# Altium project ALCT_MEZ_SPARTAN6.PrjPcb (part 4 of 5)

## Sheet FPGA_Power.SchDoc: FPGA Power
size 406 x 254 mm; Organization: UCLA High Energy Physics; DocumentNumber: 10; Revision: 2.0; SheetNumber: 10; SheetTotal: 12
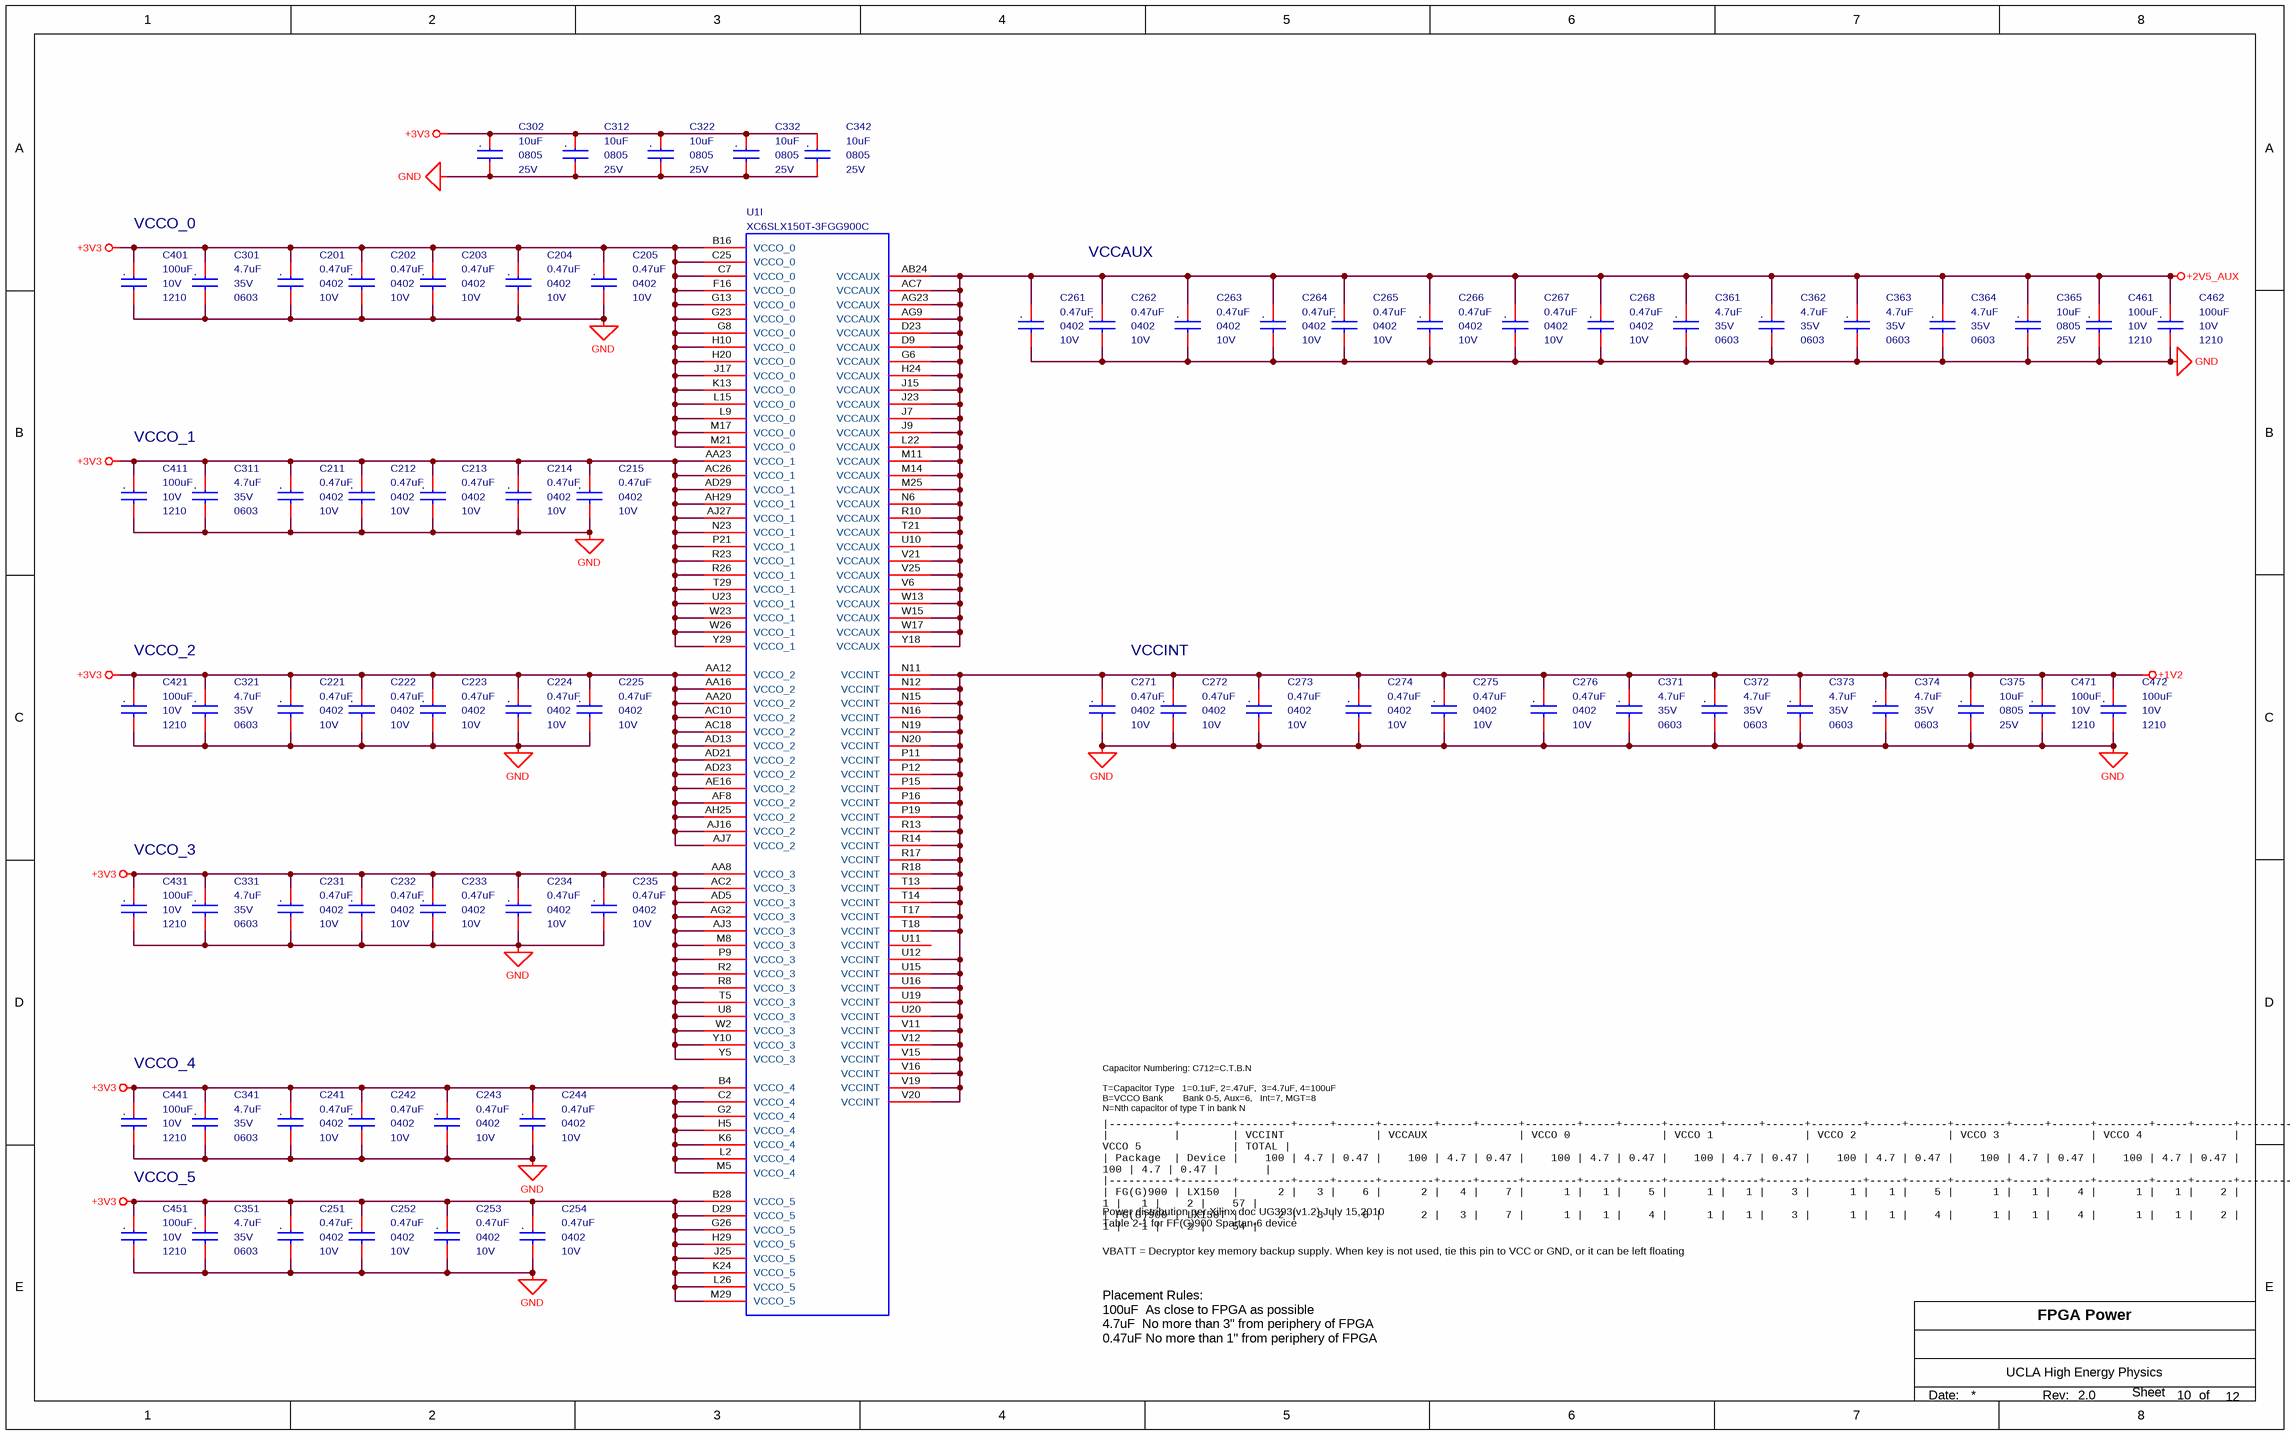
[diagram p12: FPGA_Power.SchDoc]

### Parts
C201  0.47uF  Voltage - Rated: 10V  package: 0402  [MC_S6/SM/C_0402_IPC]
C202  0.47uF  Voltage - Rated: 10V  package: 0402  [MC_S6/SM/C_0402_IPC]
C203  0.47uF  Voltage - Rated: 10V  package: 0402  [MC_S6/SM/C_0402_IPC]
C204  0.47uF  Voltage - Rated: 10V  package: 0402  [MC_S6/SM/C_0402_IPC]
C205  0.47uF  Voltage - Rated: 10V  package: 0402  [MC_S6/SM/C_0402_IPC]
C211  0.47uF  Voltage - Rated: 10V  package: 0402  [MC_S6/SM/C_0402_IPC]
C212  0.47uF  Voltage - Rated: 10V  package: 0402  [MC_S6/SM/C_0402_IPC]
C213  0.47uF  Voltage - Rated: 10V  package: 0402  [MC_S6/SM/C_0402_IPC]
C214  0.47uF  Voltage - Rated: 10V  package: 0402  [MC_S6/SM/C_0402_IPC]
C215  0.47uF  Voltage - Rated: 10V  package: 0402  [MC_S6/SM/C_0402_IPC]
C221  0.47uF  Voltage - Rated: 10V  package: 0402  [MC_S6/SM/C_0402_IPC]
C222  0.47uF  Voltage - Rated: 10V  package: 0402  [MC_S6/SM/C_0402_IPC]
C223  0.47uF  Voltage - Rated: 10V  package: 0402  [MC_S6/SM/C_0402_IPC]
C224  0.47uF  Voltage - Rated: 10V  package: 0402  [MC_S6/SM/C_0402_IPC]
C225  0.47uF  Voltage - Rated: 10V  package: 0402  [MC_S6/SM/C_0402_IPC]
C231  0.47uF  Voltage - Rated: 10V  package: 0402  [MC_S6/SM/C_0402_IPC]
C232  0.47uF  Voltage - Rated: 10V  package: 0402  [MC_S6/SM/C_0402_IPC]
C233  0.47uF  Voltage - Rated: 10V  package: 0402  [MC_S6/SM/C_0402_IPC]
C234  0.47uF  Voltage - Rated: 10V  package: 0402  [MC_S6/SM/C_0402_IPC]
C235  0.47uF  Voltage - Rated: 10V  package: 0402  [MC_S6/SM/C_0402_IPC]
C241  0.47uF  Voltage - Rated: 10V  package: 0402  [MC_S6/SM/C_0402_IPC]
C242  0.47uF  Voltage - Rated: 10V  package: 0402  [MC_S6/SM/C_0402_IPC]
C243  0.47uF  Voltage - Rated: 10V  package: 0402  [MC_S6/SM/C_0402_IPC]
C244  0.47uF  Voltage - Rated: 10V  package: 0402  [MC_S6/SM/C_0402_IPC]
C251  0.47uF  Voltage - Rated: 10V  package: 0402  [MC_S6/SM/C_0402_IPC]
C252  0.47uF  Voltage - Rated: 10V  package: 0402  [MC_S6/SM/C_0402_IPC]
C253  0.47uF  Voltage - Rated: 10V  package: 0402  [MC_S6/SM/C_0402_IPC]
C254  0.47uF  Voltage - Rated: 10V  package: 0402  [MC_S6/SM/C_0402_IPC]
C261  0.47uF  Voltage - Rated: 10V  package: 0402  [MC_S6/SM/C_0402_IPC]
C262  0.47uF  Voltage - Rated: 10V  package: 0402  [MC_S6/SM/C_0402_IPC]
C263  0.47uF  Voltage - Rated: 10V  package: 0402  [MC_S6/SM/C_0402_IPC]
C264  0.47uF  Voltage - Rated: 10V  package: 0402  [MC_S6/SM/C_0402_IPC]
C265  0.47uF  Voltage - Rated: 10V  package: 0402  [MC_S6/SM/C_0402_IPC]
C266  0.47uF  Voltage - Rated: 10V  package: 0402  [MC_S6/SM/C_0402_IPC]
C267  0.47uF  Voltage - Rated: 10V  package: 0402  [MC_S6/SM/C_0402_IPC]
C268  0.47uF  Voltage - Rated: 10V  package: 0402  [MC_S6/SM/C_0402_IPC]
C271  0.47uF  Voltage - Rated: 10V  package: 0402  [MC_S6/SM/C_0402_IPC]
C272  0.47uF  Voltage - Rated: 10V  package: 0402  [MC_S6/SM/C_0402_IPC]
C273  0.47uF  Voltage - Rated: 10V  package: 0402  [MC_S6/SM/C_0402_IPC]
C274  0.47uF  Voltage - Rated: 10V  package: 0402  [MC_S6/SM/C_0402_IPC]
C275  0.47uF  Voltage - Rated: 10V  package: 0402  [MC_S6/SM/C_0402_IPC]
C276  0.47uF  Voltage - Rated: 10V  package: 0402  [MC_S6/SM/C_0402_IPC]
C301  4.7uF  Voltage - Rated: 35V  package: 0603  [MC_S6/SM/C_0603_IPC]
C302  10uF  Voltage - Rated: 25V  package: 0805  [MC_S6/SM/C_0805_IPC]
C311  4.7uF  Voltage - Rated: 35V  package: 0603  [MC_S6/SM/C_0603_IPC]
C312  10uF  Voltage - Rated: 25V  package: 0805  [MC_S6/SM/C_0805_IPC]
C321  4.7uF  Voltage - Rated: 35V  package: 0603  [MC_S6/SM/C_0603_IPC]
C322  10uF  Voltage - Rated: 25V  package: 0805  [MC_S6/SM/C_0805_IPC]
C331  4.7uF  Voltage - Rated: 35V  package: 0603  [MC_S6/SM/C_0603_IPC]
C332  10uF  Voltage - Rated: 25V  package: 0805  [MC_S6/SM/C_0805_IPC]
C341  4.7uF  Voltage - Rated: 35V  package: 0603  [MC_S6/SM/C_0603_IPC]
C342  10uF  Voltage - Rated: 25V  package: 0805  [MC_S6/SM/C_0805_IPC]
C351  4.7uF  Voltage - Rated: 35V  package: 0603  [MC_S6/SM/C_0603_IPC]
C361  4.7uF  Voltage - Rated: 35V  package: 0603  [MC_S6/SM/C_0603_IPC]
C362  4.7uF  Voltage - Rated: 35V  package: 0603  [MC_S6/SM/C_0603_IPC]
C363  4.7uF  Voltage - Rated: 35V  package: 0603  [MC_S6/SM/C_0603_IPC]
C364  4.7uF  Voltage - Rated: 35V  package: 0603  [MC_S6/SM/C_0603_IPC]
C365  10uF  Voltage - Rated: 25V  package: 0805  [MC_S6/SM/C_0805_IPC]
C371  4.7uF  Voltage - Rated: 35V  package: 0603  [MC_S6/SM/C_0603_IPC]
C372  4.7uF  Voltage - Rated: 35V  package: 0603  [MC_S6/SM/C_0603_IPC]
C373  4.7uF  Voltage - Rated: 35V  package: 0603  [MC_S6/SM/C_0603_IPC]
C374  4.7uF  Voltage - Rated: 35V  package: 0603  [MC_S6/SM/C_0603_IPC]
C375  10uF  Voltage - Rated: 25V  package: 0805  [MC_S6/SM/C_0805_IPC]
C401  100uF  Voltage - Rated: 10V  package: 1210  [MC_S6/SM/C_1210_IPC]
C411  100uF  Voltage - Rated: 10V  package: 1210  [MC_S6/SM/C_1210_IPC]
C421  100uF  Voltage - Rated: 10V  package: 1210  [MC_S6/SM/C_1210_IPC]
C431  100uF  Voltage - Rated: 10V  package: 1210  [MC_S6/SM/C_1210_IPC]
C441  100uF  Voltage - Rated: 10V  package: 1210  [MC_S6/SM/C_1210_IPC]
C451  100uF  Voltage - Rated: 10V  package: 1210  [MC_S6/SM/C_1210_IPC]
C461  100uF  Voltage - Rated: 10V  package: 1210  [MC_S6/SM/C_1210_IPC]
C462  100uF  Voltage - Rated: 10V  package: 1210  [MC_S6/SM/C_1210_IPC]
C471  100uF  Voltage - Rated: 10V  package: 1210  [MC_S6/SM/C_1210_IPC]
C472  100uF  Voltage - Rated: 10V  package: 1210  [MC_S6/SM/C_1210_IPC]
U1  XC6SLX150T-3FGG900C  [MC_S6/BGA/FGG900]  (part I of 13)

### Nets
+1V2: C271.1 C272.1 C273.1 C274.1 C275.1 C276.1 C371.1 C372.1 C373.1 C374.1 C375.1 C471.1 C472.1 U1.N11(VCCINT) U1.N12(VCCINT) U1.N15(VCCINT) U1.N16(VCCINT) U1.N19(VCCINT) U1.N20(VCCINT) U1.P11(VCCINT) U1.P12(VCCINT) U1.P15(VCCINT) U1.P16(VCCINT) U1.P19(VCCINT) U1.R13(VCCINT) U1.R14(VCCINT) U1.R17(VCCINT) U1.R18(VCCINT) U1.T13(VCCINT) U1.T14(VCCINT) U1.T17(VCCINT) U1.T18(VCCINT) U1.U12(VCCINT) U1.U15(VCCINT) U1.U16(VCCINT) U1.U19(VCCINT) U1.U20(VCCINT) U1.V11(VCCINT) U1.V12(VCCINT) U1.V15(VCCINT) U1.V16(VCCINT) U1.V19(VCCINT) U1.V20(VCCINT)
+2V5_AUX: C261.1 C262.1 C263.1 C264.1 C265.1 C266.1 C267.1 C268.1 C361.1 C362.1 C363.1 C364.1 C365.1 C461.1 C462.1 U1.AB24(VCCAUX) U1.AC7(VCCAUX) U1.AG9(VCCAUX) U1.AG23(VCCAUX) U1.D9(VCCAUX) U1.D23(VCCAUX) U1.G6(VCCAUX) U1.H24(VCCAUX) U1.J7(VCCAUX) U1.J9(VCCAUX) U1.J15(VCCAUX) U1.J23(VCCAUX) U1.L22(VCCAUX) U1.M11(VCCAUX) U1.M14(VCCAUX) U1.M25(VCCAUX) U1.N6(VCCAUX) U1.R10(VCCAUX) U1.T21(VCCAUX) U1.U10(VCCAUX) U1.V6(VCCAUX) U1.V21(VCCAUX) U1.V25(VCCAUX) U1.W13(VCCAUX) U1.W15(VCCAUX) U1.W17(VCCAUX) U1.Y18(VCCAUX)
+3V3: C201.1 C202.1 C203.1 C204.1 C205.1 C211.1 C212.1 C213.1 C214.1 C215.1 C221.1 C222.1 C223.1 C224.1 C225.1 C231.1 C232.1 C233.1 C234.1 C235.1 C241.1 C242.1 C243.1 C244.1 C251.1 C252.1 C253.1 C254.1 C301.1 C302.1 C311.1 C312.1 C321.1 C322.1 C331.1 C332.1 C341.1 C342.1 C351.1 C401.1 C411.1 C421.1 C431.1 C441.1 C451.1 U1.AA8(VCCO_3) U1.AA12(VCCO_2) U1.AA16(VCCO_2) U1.AA20(VCCO_2) U1.AA23(VCCO_1) U1.AC2(VCCO_3) U1.AC10(VCCO_2) U1.AC18(VCCO_2) U1.AC26(VCCO_1) U1.AD5(VCCO_3) U1.AD13(VCCO_2) U1.AD21(VCCO_2) U1.AD23(VCCO_2) U1.AD29(VCCO_1) U1.AE16(VCCO_2) U1.AF8(VCCO_2) U1.AG2(VCCO_3) U1.AH25(VCCO_2) U1.AH29(VCCO_1) U1.AJ3(VCCO_3) U1.AJ7(VCCO_2) U1.AJ16(VCCO_2) U1.AJ27(VCCO_1) U1.B4(VCCO_4) U1.B16(VCCO_0) U1.B28(VCCO_5) U1.C2(VCCO_4) U1.C7(VCCO_0) U1.C25(VCCO_0) U1.D29(VCCO_5) U1.F16(VCCO_0) U1.G2(VCCO_4) U1.G8(VCCO_0) U1.G13(VCCO_0) U1.G23(VCCO_0) U1.G26(VCCO_5) U1.H5(VCCO_4) U1.H10(VCCO_0) U1.H20(VCCO_0) U1.H29(VCCO_5) U1.J17(VCCO_0) U1.J25(VCCO_5) U1.K6(VCCO_4) U1.K13(VCCO_0) U1.K24(VCCO_5) U1.L2(VCCO_4) U1.L9(VCCO_0) U1.L15(VCCO_0) U1.L26(VCCO_5) U1.M5(VCCO_4) U1.M8(VCCO_3) U1.M17(VCCO_0) U1.M21(VCCO_0) U1.M29(VCCO_5) U1.N23(VCCO_1) U1.P9(VCCO_3) U1.P21(VCCO_1) U1.R2(VCCO_3) U1.R8(VCCO_3) U1.R23(VCCO_1) U1.R26(VCCO_1) U1.T5(VCCO_3) U1.T29(VCCO_1) U1.U8(VCCO_3) U1.U23(VCCO_1) U1.W2(VCCO_3) U1.W23(VCCO_1) U1.W26(VCCO_1) U1.Y5(VCCO_3) U1.Y10(VCCO_3) U1.Y29(VCCO_1)
GND: C201.2 C202.2 C203.2 C204.2 C205.2 C211.2 C212.2 C213.2 C214.2 C215.2 C221.2 C222.2 C223.2 C224.2 C225.2 C231.2 C232.2 C233.2 C234.2 C235.2 C241.2 C242.2 C243.2 C244.2 C251.2 C252.2 C253.2 C254.2 C261.2 C262.2 C263.2 C264.2 C265.2 C266.2 C267.2 C268.2 C271.2 C272.2 C273.2 C274.2 C275.2 C276.2 C301.2 C302.2 C311.2 C312.2 C321.2 C322.2 C331.2 C332.2 C341.2 C342.2 C351.2 C361.2 C362.2 C363.2 C364.2 C365.2 C371.2 C372.2 C373.2 C374.2 C375.2 C401.2 C411.2 C421.2 C431.2 C441.2 C451.2 C461.2 C462.2 C471.2 C472.2

Not connected (* = marked no-connect by the designer): U1 U11(VCCINT)

### Notes on the sheet
- VCCO_0
- VCCAUX
- VCCO_1
- VCCO_2
- VCCINT
- VCCO_3
- VCCO_4
- Capacitor Numbering: C712=C.T.B.N
  T=Capacitor Type   1=0.1uF, 2=.47uF,  3=4.7uF, 4=100uF
  B=VCCO Bank        Bank 0-5, Aux=6,   Int=7, MGT=8
  N=Nth capacitor of type T in bank N
- VCCO_5
- Power distribution per Xilinx doc UG393(v1.2) July 15,2010
  Table 2-1 for FF(G)900 Spartan-6 device
- |----------+--------+--------+-----+------+--------+-----+------+--------+-----+------+--------+-----+------+--------+-----+------+--------+-----+------+--------+-----+------+--------+-----+------+-------|
  |          |        | VCCINT              | VCCAUX              | VCCO 0              | VCCO 1              | VCCO 2              | VCCO 3              | VCCO 4              | VCCO 5              | TOTAL |
  | Package  | Device |    100 | 4.7 | 0.47 |    100 | 4.7 | 0.47 |    100 | 4.7 | 0.47 |    100 | 4.7 | 0.47 |    100 | 4.7 | 0.47 |    100 | 4.7 | 0.47 |    100 | 4.7 | 0.47 |    100 | 4.7 | 0.47 |       |
  |----------+--------+--------+-----+------+--------+-----+------+--------+-----+------+--------+-----+------+--------+-----+------+--------+-----+------+--------+-----+------+--------+-----+------+-------|
  | FG(G)900 | LX150  |      2 |   3 |    6 |      2 |   4 |    7 |      1 |   1 |    5 |      1 |   1 |    3 |      1 |   1 |    5 |      1 |   1 |    4 |      1 |   1 |    2 |      1 |   1 |    2 |    57 |
  | FG(G)900 | LX150T |      2 |   3 |    6 |      2 |   3 |    7 |      1 |   1 |    4 |      1 |   1 |    3 |      1 |   1 |    4 |      1 |   1 |    4 |      1 |   1 |    2 |      1 |   1 |    2 |    54 |
  |----------+--------+--------+-----+------+--------+-----+------+--------+-----+------+--------+-----+------+--------+-----+------+--------+-----+------+--------+-----+------+--------+-----+------+-------|
- VBATT = Decryptor key memory backup supply. When key is not used, tie this pin to VCC or GND, or it can be left floating
- Placement Rules:
  100uF  As close to FPGA as possible
  4.7uF  No more than 3" from periphery of FPGA
  0.47uF No more than 1" from periphery of FPGA
- Date:
- Rev:
- of
- Sheet
- (in symbol GRM21BR61E106KA73L) .
- (in symbol GRM155R61A474KE15J) .
- (in symbol GRM188R6YA475KE15D) .
- (in symbol LMK325BJ107MM-T) .

### Library data of the parts
C201-C205 C211-C215 C221-C225 C231-C235 C241-C244 C251-C254 C261-C268 C271-C276 = GRM155R61A474KE15J: CAP CER 0.47UF 10V X5R 0402; Manufacturer: Murata Electronics North America; Capacitance: 0.47µF; Tolerance: ±10%; Supplier 1: Digi-Key; Manufacturer Part Number: GRM155R61A474KE15J; RoHS: RoHS Compliant; Category: Capacitors; Stock 1: 35266; Pricing 1: 1=0.1, 10=0.074, 100=0.0329, 500=0.02348, 1000=0.01845, 2500=0.01678, 5000=0.01543 (USD); Packaging: Cut Tape (CT); Part Status: Active; Operating Temperature: -55°C ~ 85°C; Features: -; Ratings: -; Applications: General Purpose; Mounting Type: Surface Mount, MLCC; Package / Case: 0402 (1005 Metric); Size / Dimension: 0.039" L x 0.020" W (1.00mm x 0.50mm); Height - Seated (Max): -; Thickness (Max): 0.022" (0.55mm); Lead Spacing: -; ComponentLink1URL: http://www.murata.com/~/media/webrenewal/support/library/catalog/products/capacitor/mlcc/c02e.ashx; ComponentLink1Description: http://www.murata.com/~/media/webrenewal/support/library/catalog/products/capacitor/mlcc/c02e.ashx; Supplier 2: Digi-Key; Stock 2: 35286; Pricing 2: 1=0.1, 10=0.074, 100=0.0329, 500=0.02348, 1000=0.01845, 2500=0.01678, 5000=0.01543 (USD); Supplier Part Number 1: 490-6305-1-ND; Supplier Part Number 2: 490-6305-6-ND; Temperature Coefficient: X5R
C301 C311 C321 C331 C341 C351 C361-C364 C371-C374 = GRM188R6YA475KE15D: CAP CER 4.7UF 35V X5R 0603; Manufacturer: Murata; Capacitance: 4.7µF; Tolerance: ±10%; Product Training Modules: High-Cap Multilayer Ceramic Capacitors; Featured Product: GA3 Safety Recognized Capacitors; EDA / CAD Models: Download from Accelerated Designs; Online Catalog: GRM Series; Other Names: 490-7205-2; Supplier 1: Digikey; Manufacturer Part Number: GRM188R6YA475KE15D; Category: Capacitors; Stock 1: 180441; Pricing 1: 1=0.32, 10=0.264, 50=0.1486, 100=0.132, 250=0.099, 500=0.0875, 1000=0.0776 (USD); Packaging: Tape & Reel (TR); Temperature Coefficient: X5R; Operating Temperature: -55°C ~ 85°C; Applications: General Purpose; Mounting Type: Surface Mount, MLCC; Package / Case: 0603 (1608 Metric); Size / Dimension: 0.063" L x 0.031" W (1.60mm x 0.80mm); Thickness (Max): 0.031" (0.80mm); ComponentLink1URL: https://datasheet.ciiva.com/46444/1769893-46444984.pdf; ComponentLink1Description: https://datasheet.ciiva.com/46444/1769893-46444984.pdf; Supplier 2: Digikey; Stock 2: 180441; Pricing 2: 1=0.32, 10=0.264, 50=0.1486, 100=0.132, 250=0.099, 500=0.0875, 1000=0.0776 (USD); Supplier Part Number 1: 490-7205-1-ND; Supplier Part Number 2: 490-7205-6-ND; Standard Package: 4,000; Family: Ceramic Capacitors; Series: GRM; ComponentLink2URL: https://datasheet.ciiva.com/46444/1769893-46444985.pdf; ComponentLink2Description: https://datasheet.ciiva.com/46444/1769893-46444985.pdf; ComponentLink3URL: https://datasheet.ciiva.com/14906/partnumbering-e-01-14906426.pdf; ComponentLink3Description: https://datasheet.ciiva.com/14906/partnumbering-e-01-14906426.pdf; ComponentLink4URL: https://datasheet.ciiva.com/14906/partnumbering-e-01-14906427.pdf; ComponentLink4Description: https://datasheet.ciiva.com/14906/partnumbering-e-01-14906427.pdf; ComponentLink5URL: https://datasheet.ciiva.com/14906/partnumbering-e-01-14906428.pdf; ComponentLink5Description: https://datasheet.ciiva.com/14906/partnumbering-e-01-14906428.pdf
C302 C312 C322 C332 C342 C365 C375 = GRM21BR61E106KA73L: CAP CER 10UF 25V X5R 0805; Manufacturer: Murata Electronics North America; Capacitance: 10µF; Tolerance: ±10%; Supplier 1: Digi-Key; Manufacturer Part Number: GRM21BR61E106KA73L; RoHS: RoHS Compliant; Category: Capacitors; Stock 1: 607428; Pricing 1: 1=0.19, 10=0.13, 50=0.0748, 100=0.0618, 250=0.052, 500=0.04356, 1000=0.03575 (USD); Packaging: Cut Tape (CT); Part Status: Active; Temperature Coefficient: X5R; Operating Temperature: -55°C ~ 85°C; Features: -; Ratings: -; Applications: General Purpose; Mounting Type: Surface Mount, MLCC; Package / Case: 0805 (2012 Metric); Size / Dimension: 0.079" L x 0.049" W (2.00mm x 1.25mm); Height - Seated (Max): -; Thickness (Max): 0.053" (1.35mm); Lead Spacing: -; Lead Style: -; ComponentLink1URL: http://www.murata.com/~/media/webrenewal/support/library/catalog/products/capacitor/mlcc/c02e.pdf; ComponentLink1Description: http://www.murata.com/~/media/webrenewal/support/library/catalog/products/capacitor/mlcc/c02e.pdf; Supplier 2: Digi-Key; Supplier Part Number 1: 490-5523-1-ND; Supplier Part Number 2: 490-5523-6-ND
C401 C411 C421 C431 C441 C451 C461 C462 C471 C472 = LMK325BJ107MM-T: CAP CER 100UF 10V X5R 1210; Manufacturer: Taiyo Yuden; Capacitance: 100µF; Tolerance: ±20%; Supplier 1: Digi-Key; Manufacturer Part Number: LMK325BJ107MM-T; RoHS: RoHS Compliant; Category: Capacitors; Stock 1: 345948; Pricing 1: 1=1.15, 10=0.909, 25=0.8332, 50=0.7878, 100=0.6818, 250=0.60608 (USD); Packaging: Cut Tape (CT); Part Status: Active; Temperature Coefficient: X5R; Operating Temperature: -55°C ~ 85°C; Features: -; Ratings: -; Applications: General Purpose; Mounting Type: Surface Mount, MLCC; Package / Case: 1210 (3225 Metric); Size / Dimension: 0.126" L x 0.098" W (3.20mm x 2.50mm); Height - Seated (Max): -; Thickness (Max): 0.106" (2.70mm); Lead Spacing: -; Lead Style: -; ComponentLink1URL: http://www.yuden.co.jp/productdata/catalog/en/mlcc_all_e.pdf; ComponentLink1Description: http://www.yuden.co.jp/productdata/catalog/en/mlcc_all_e.pdf; Supplier 2: Digi-Key; Stock 2: 345948; Pricing 2: 1=1.16, 10=0.914, 25=0.8376, 50=0.792, 100=0.6855, 250=0.60932 (USD); Supplier Part Number 1: 587-1965-1-ND; Supplier Part Number 2: 587-1965-6-ND
U1 = XC6SLX150T-3FGG900C: Spartan-6 LXT 1.2V FPGA, 540 User I/Os, 900-Ball Chip-Scale BGA (1.0mm Pitch), Speed Grade 3, Commercial Grade, Pb-Free; Manufacturer: Xilinx Inc.; Number of I/O: 540; Voltage - Supply: 1.14 V ~ 1.26 V; DatasheetVersion: ver1.6, Nov-2010; PackageVersion: ver1.4, Nov-2009; PackageReference: FGG900; PackageDescription: 900-Ball Fine-Pitch Ball Grid Array (FGG900) - Pb-Free; Code_JEDEC: MS-034-AAN-1; Code_IPC: BGA100P30X30-900; ComponentLink1Description: Manufacturer URL; ComponentLink1URL: http://www.xilinx.com/; ComponentLink2Description: Spartan-6 Datasheet; ComponentLink2URL: http://www.xilinx.com/support/documentation/data_sheets/ds160.pdf; ComponentLink3Description: Spartan-6 Documents; ComponentLink3URL: http://www.xilinx.com/support/documentation/spartan-6.htm; Supplier 1: Digi-Key; Manufacturer Part Number: XC6SLX150T-3FGG900C; RoHS: RoHS Compliant; Category: Integrated Circuits (ICs); Stock 1: 0; Pricing 1: 27=287.3 (USD); Part Status: Active; Mounting Type: Surface Mount; Operating Temperature: 0°C ~ 85°C (TJ); Package / Case: 900-BBGA; Supplier Device Package: 900-FBGA (31x31); ComponentLink4URL: http://www.xilinx.com/support/documentation/data_sheets/ds162.pdf; ComponentLink4Description: http://www.xilinx.com/support/documentation/data_sheets/ds162.pdf; Supplier Part Number 1: XC6SLX150T-3FGG900C-ND

## Sheet FPGA_Ground.SchDoc: FPGA Ground
size A portrait; Organization: UCLA High Energy Physics; DocumentNumber: 11; Revision: 1.0; SheetNumber: 11; SheetTotal: 12; CurrentDate: 8/7/2018; ModifiedDate: 2/7/2018
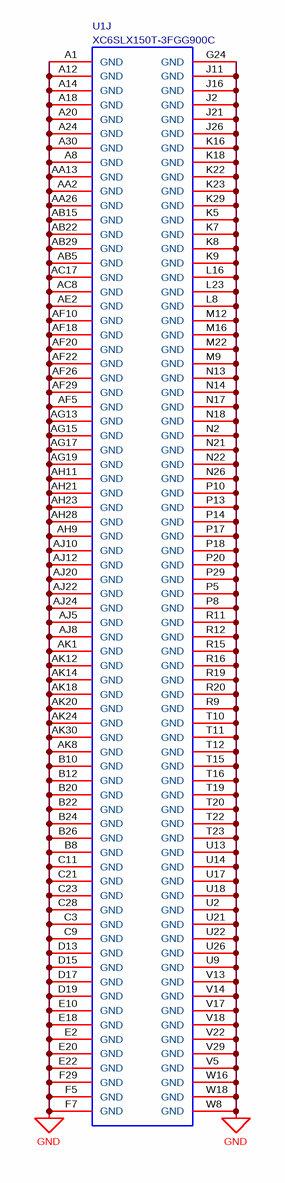
[diagram p13: FPGA_Ground.SchDoc]

### Parts
U1  XC6SLX150T-3FGG900C  [MC_S6/BGA/FGG900]  (part J of 13)

### Nets
GND: U1.A1(GND) U1.A8(GND) U1.A12(GND) U1.A14(GND) U1.A18(GND) U1.A20(GND) U1.A24(GND) U1.A30(GND) U1.AA2(GND) U1.AA13(GND) U1.AA26(GND) U1.AB5(GND) U1.AB15(GND) U1.AB22(GND) U1.AB29(GND) U1.AC8(GND) U1.AC17(GND) U1.AE2(GND) U1.AF5(GND) U1.AF10(GND) U1.AF18(GND) U1.AF20(GND) U1.AF22(GND) U1.AF26(GND) U1.AF29(GND) U1.AG13(GND) U1.AG15(GND) U1.AG17(GND) U1.AG19(GND) U1.AH9(GND) U1.AH11(GND) U1.AH21(GND) U1.AH23(GND) U1.AH28(GND) U1.AJ5(GND) U1.AJ8(GND) U1.AJ10(GND) U1.AJ12(GND) U1.AJ20(GND) U1.AJ22(GND) U1.AJ24(GND) U1.AK1(GND) U1.AK8(GND) U1.AK12(GND) U1.AK14(GND) U1.AK18(GND) U1.AK20(GND) U1.AK24(GND) U1.AK30(GND) U1.B8(GND) U1.B10(GND) U1.B12(GND) U1.B20(GND) U1.B22(GND) U1.B24(GND) U1.B26(GND) U1.C3(GND) U1.C9(GND) U1.C11(GND) U1.C21(GND) U1.C23(GND) U1.C28(GND) U1.D13(GND) U1.D15(GND) U1.D17(GND) U1.D19(GND) U1.E2(GND) U1.E10(GND) U1.E18(GND) U1.E20(GND) U1.E22(GND) U1.F5(GND) U1.F7(GND) U1.F29(GND) U1.G24(GND) U1.J2(GND) U1.J11(GND) U1.J16(GND) U1.J21(GND) U1.J26(GND) U1.K5(GND) U1.K7(GND) U1.K8(GND) U1.K9(GND) U1.K16(GND) U1.K18(GND) U1.K22(GND) U1.K23(GND) U1.K29(GND) U1.L8(GND) U1.L16(GND) U1.L23(GND) U1.M9(GND) U1.M12(GND) U1.M16(GND) U1.M22(GND) U1.N2(GND) U1.N13(GND) U1.N14(GND) U1.N17(GND) U1.N18(GND) U1.N21(GND) U1.N22(GND) U1.N26(GND) U1.P5(GND) U1.P8(GND) U1.P10(GND) U1.P13(GND) U1.P14(GND) U1.P17(GND) U1.P18(GND) U1.P20(GND) U1.P29(GND) U1.R9(GND) U1.R11(GND) U1.R12(GND) U1.R15(GND) U1.R16(GND) U1.R19(GND) U1.R20(GND) U1.T10(GND) U1.T11(GND) U1.T12(GND) U1.T15(GND) U1.T16(GND) U1.T19(GND) U1.T20(GND) U1.T22(GND) U1.T23(GND) U1.U2(GND) U1.U9(GND) U1.U13(GND) U1.U14(GND) U1.U17(GND) U1.U18(GND) U1.U21(GND) U1.U22(GND) U1.U26(GND) U1.V5(GND) U1.V13(GND) U1.V14(GND) U1.V17(GND) U1.V18(GND) U1.V22(GND) U1.V29(GND) U1.W8(GND) U1.W16(GND) U1.W18(GND)

### Notes on the sheet
- Date:
- Rev:
- of
- Sheet

### Library data of the parts
U1 = XC6SLX150T-3FGG900C: as U1 on sheet FPGA_Power; DatasheetVersion: ver1.6, Nov-2010; PackageVersion: ver1.4, Nov-2009; PackageReference: FGG900; PackageDescription: 900-Ball Fine-Pitch Ball Grid Array (FGG900) - Pb-Free; Code_JEDEC: MS-034-AAN-1; Code_IPC: BGA100P30X30-900; ComponentLink1Description: Manufacturer URL; ComponentLink1URL: http://www.xilinx.com/; ComponentLink2Description: Spartan-6 Datasheet; ComponentLink2URL: http://www.xilinx.com/support/documentation/data_sheets/ds160.pdf; ComponentLink3Description: Spartan-6 Documents; ComponentLink3URL: http://www.xilinx.com/support/documentation/spartan-6.htm; Supplier 1: Digi-Key; Manufacturer Part Number: XC6SLX150T-3FGG900C; RoHS: RoHS Compliant; Category: Integrated Circuits (ICs); Stock 1: 0; Pricing 1: 27=287.3 (USD); Part Status: Active; Mounting Type: Surface Mount; Operating Temperature: 0°C ~ 85°C (TJ); Package / Case: 900-BBGA; Supplier Device Package: 900-FBGA (31x31); ComponentLink4URL: http://www.xilinx.com/support/documentation/data_sheets/ds162.pdf; ComponentLink4Description: http://www.xilinx.com/support/documentation/data_sheets/ds162.pdf; Supplier Part Number 1: XC6SLX150T-3FGG900C-ND

## Sheet Power.SchDoc: Power
size B; Organization: UCLA High Energy Physics; DocumentNumber: 9; Revision: 2.0; SheetNumber: 9; SheetTotal: 12; CurrentDate: 8/7/2018; ModifiedDate: 8/20/2018; Rule: PcbType=ProtelPcb
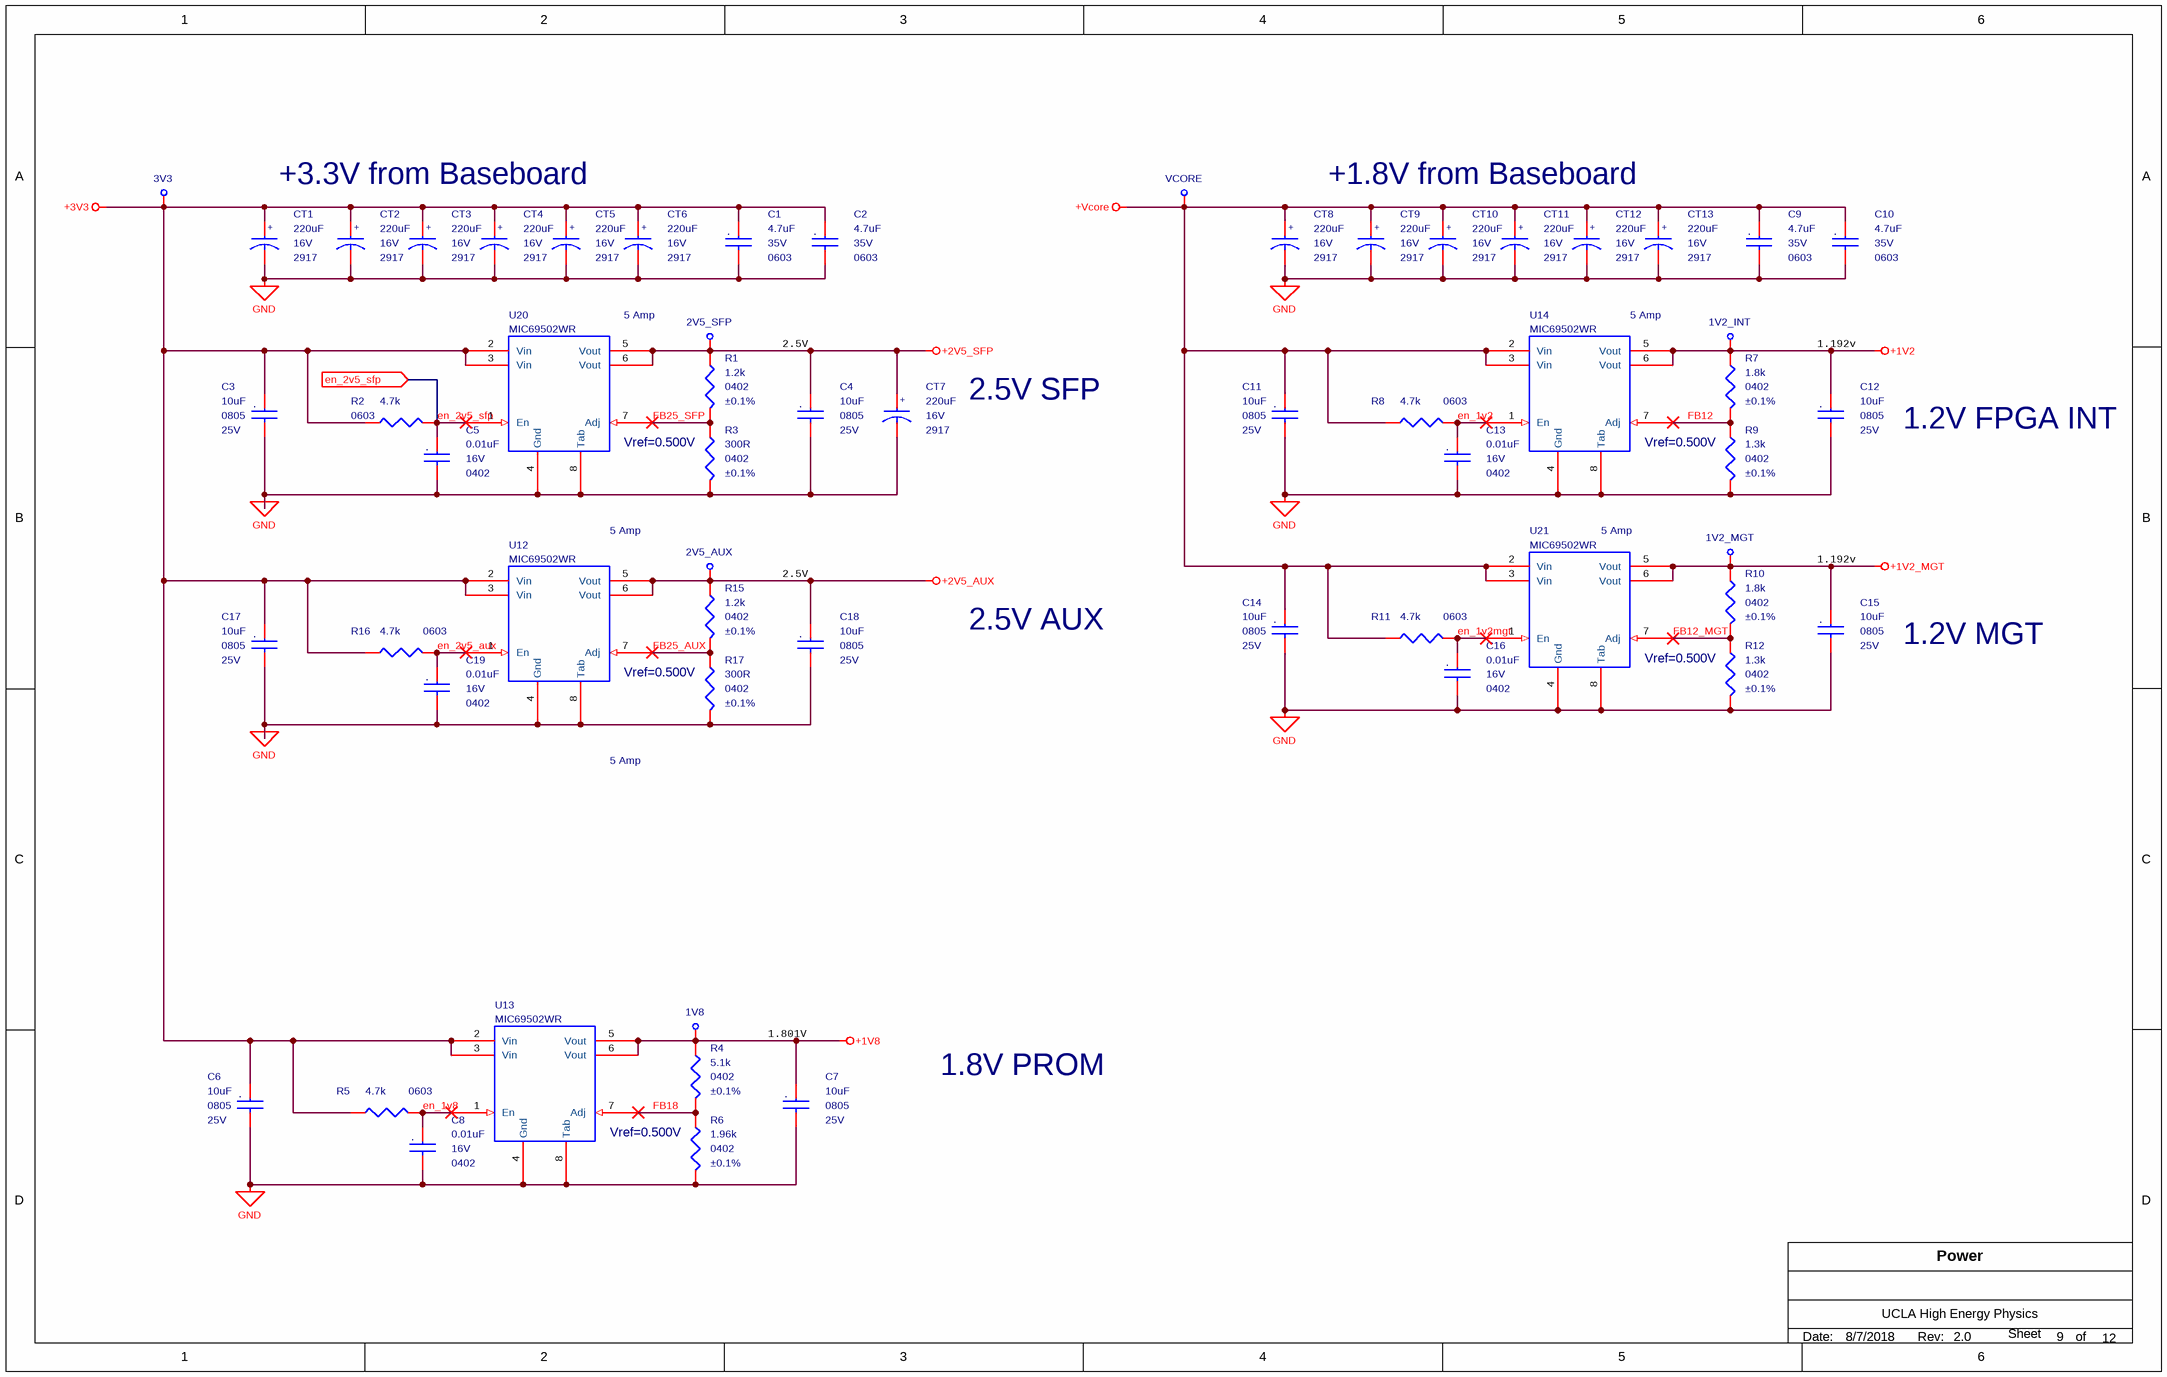
[diagram p14: Power.SchDoc]

### Parts
1V2_INT  Test Point Via  [MC_S6/TH/TPVIA]  (value not drawn)  (no BOM)
1V2_MGT  Test Point Via  [MC_S6/TH/TPVIA]  (value not drawn)  (no BOM)
1V8  Test Point Via  [MC_S6/TH/TPVIA]  (value not drawn)  (no BOM)
2V5_AUX  Test Point Via  [MC_S6/TH/TPVIA]  (value not drawn)  (no BOM)
2V5_SFP  Test Point Via  [MC_S6/TH/TPVIA]  (value not drawn)  (no BOM)
3V3  Test Point Via  [MC_S6/TH/TPVIA]  (value not drawn)  (no BOM)
C1  4.7uF  Voltage - Rated: 35V  package: 0603  [MC_S6/SM/C_0603_IPC]
C2  4.7uF  Voltage - Rated: 35V  package: 0603  [MC_S6/SM/C_0603_IPC]
C3  10uF  Voltage - Rated: 25V  package: 0805  [MC_S6/SM/C_0805_IPC]
C4  10uF  Voltage - Rated: 25V  package: 0805  [MC_S6/SM/C_0805_IPC]
C5  0.01uF  Voltage - Rated: 16V  package: 0402  [MC_S6/SM/C_0402_IPC]
C6  10uF  Voltage - Rated: 25V  package: 0805  [MC_S6/SM/C_0805_IPC]
C7  10uF  Voltage - Rated: 25V  package: 0805  [MC_S6/SM/C_0805_IPC]
C8  0.01uF  Voltage - Rated: 16V  package: 0402  [MC_S6/SM/C_0402_IPC]
C9  4.7uF  Voltage - Rated: 35V  package: 0603  [MC_S6/SM/C_0603_IPC]
C10  4.7uF  Voltage - Rated: 35V  package: 0603  [MC_S6/SM/C_0603_IPC]
C11  10uF  Voltage - Rated: 25V  package: 0805  [MC_S6/SM/C_0805_IPC]
C12  10uF  Voltage - Rated: 25V  package: 0805  [MC_S6/SM/C_0805_IPC]
C13  0.01uF  Voltage - Rated: 16V  package: 0402  [MC_S6/SM/C_0402_IPC]
C14  10uF  Voltage - Rated: 25V  package: 0805  [MC_S6/SM/C_0805_IPC]
C15  10uF  Voltage - Rated: 25V  package: 0805  [MC_S6/SM/C_0805_IPC]
C16  0.01uF  Voltage - Rated: 16V  package: 0402  [MC_S6/SM/C_0402_IPC]
C17  10uF  Voltage - Rated: 25V  package: 0805  [MC_S6/SM/C_0805_IPC]
C18  10uF  Voltage - Rated: 25V  package: 0805  [MC_S6/SM/C_0805_IPC]
C19  0.01uF  Voltage - Rated: 16V  package: 0402  [MC_S6/SM/C_0402_IPC]
CT1  220uF  Voltage - Rated: 16V  package: 2917  [MC_S6/SM/CT_2917_D]
CT2  220uF  Voltage - Rated: 16V  package: 2917  [MC_S6/SM/CT_2917_D]
CT3  220uF  Voltage - Rated: 16V  package: 2917  [MC_S6/SM/CT_2917_D]
CT4  220uF  Voltage - Rated: 16V  package: 2917  [MC_S6/SM/CT_2917_D]
CT5  220uF  Voltage - Rated: 16V  package: 2917  [MC_S6/SM/CT_2917_D]
CT6  220uF  Voltage - Rated: 16V  package: 2917  [MC_S6/SM/CT_2917_D]
CT7  220uF  Voltage - Rated: 16V  package: 2917  [MC_S6/SM/CT_2917_D]
CT8  220uF  Voltage - Rated: 16V  package: 2917  [MC_S6/SM/CT_2917_D]
CT9  220uF  Voltage - Rated: 16V  package: 2917  [MC_S6/SM/CT_2917_D]
CT10  220uF  Voltage - Rated: 16V  package: 2917  [MC_S6/SM/CT_2917_D]
CT11  220uF  Voltage - Rated: 16V  package: 2917  [MC_S6/SM/CT_2917_D]
CT12  220uF  Voltage - Rated: 16V  package: 2917  [MC_S6/SM/CT_2917_D]
CT13  220uF  Voltage - Rated: 16V  package: 2917  [MC_S6/SM/CT_2917_D]
R1  1.2k  Tolerance: ±0.1%  package: 0402  [MC_S6/SM/R_0402_IPC]
R2  4.7k  Supplier Device Package: 0603  [MC_S6/SM/R_0603_IPC]
R3  300R  Tolerance: ±0.1%  package: 0402  [MC_S6/SM/R_0402_IPC]
R4  5.1k  Tolerance: ±0.1%  Supplier Device Package: 0402  [MC_S6/SM/R_0402_IPC]
R5  4.7k  Supplier Device Package: 0603  [MC_S6/SM/R_0603_IPC]
R6  1.96k  Tolerance: ±0.1%  package: 0402  [MC_S6/SM/R_0402_IPC]
R7  1.8k  Tolerance: ±0.1%  package: 0402  [MC_S6/SM/R_0402_IPC]
R8  4.7k  Supplier Device Package: 0603  [MC_S6/SM/R_0603_IPC]
R9  1.3k  Tolerance: ±0.1%  Supplier Device Package: 0402  [MC_S6/SM/R_0402_IPC]
R10  1.8k  Tolerance: ±0.1%  Supplier Device Package: 0402  [MC_S6/SM/R_0402_IPC]
R11  4.7k  Supplier Device Package: 0603  [MC_S6/SM/R_0603_IPC]
R12  1.3k  Tolerance: ±0.1%  Supplier Device Package: 0402  [MC_S6/SM/R_0402_IPC]
R15  1.2k  Tolerance: ±0.1%  package: 0402  [MC_S6/SM/R_0402_IPC]
R16  4.7k  Supplier Device Package: 0603  [MC_S6/SM/R_0603_IPC]
R17  300R  Tolerance: ±0.1%  package: 0402  [MC_S6/SM/R_0402_IPC]
U12  MIC69502WR  [MC_S6/SM/SPAK7]
U13  MIC69502WR  [MC_S6/SM/SPAK7]
U14  MIC69502WR  [MC_S6/SM/SPAK7]
U20  MIC69502WR  [MC_S6/SM/SPAK7]
U21  MIC69502WR  [MC_S6/SM/SPAK7]
VCORE  Test Point Via  [MC_S6/TH/TPVIA]  (value not drawn)  (no BOM)

### Ports
en_2v5_sfp (in)

### Nets
+1V2: 1V2_INT.1(In) C12.1 R7.1 U14.5(Vout) U14.6(Vout)
+1V2_MGT: 1V2_MGT.1(In) C15.1 R10.1 U21.5(Vout) U21.6(Vout)
+1V8: 1V8.1(In) C7.1 R4.1 U13.5(Vout) U13.6(Vout)
+2V5_AUX: 2V5_AUX.1(In) C18.1 R15.1 U12.5(Vout) U12.6(Vout)
+2V5_SFP: 2V5_SFP.1(In) C4.1 CT7.1 R1.1 U20.5(Vout) U20.6(Vout)
+3V3: 3V3.1(In) C1.1 C2.1 C3.1 C6.1 C17.1 CT1.1 CT2.1 CT3.1 CT4.1 CT5.1 CT6.1 R2.1 R5.1 R16.1 U12.2(Vin) U12.3(Vin) U13.2(Vin) U13.3(Vin) U20.2(Vin) U20.3(Vin)
+Vcore: C9.1 C10.1 C11.1 C14.1 CT8.1 CT9.1 CT10.1 CT11.1 CT12.1 CT13.1 R8.1 R11.1 U14.2(Vin) U14.3(Vin) U21.2(Vin) U21.3(Vin) VCORE.1(In)
GND: C1.2 C2.2 C3.2 C4.2 C5.2 C6.2 C7.2 C8.2 C9.2 C10.2 C11.2 C12.2 C13.2 C14.2 C15.2 C16.2 C17.2 C18.2 C19.2 CT1.2 CT2.2 CT3.2 CT4.2 CT5.2 CT6.2 CT7.2 CT8.2 CT9.2 CT10.2 CT11.2 CT12.2 CT13.2 R3.2 R6.2 R9.2 R12.2 R17.2 U12.4(Gnd) U12.8(Tab) U13.4(Gnd) U13.8(Tab) U14.4(Gnd) U14.8(Tab) U20.4(Gnd) U20.8(Tab) U21.4(Gnd) U21.8(Tab)
en_1v2: C13.1 R8.2 U14.1(En)
en_1v2mgt: C16.1 R11.2 U21.1(En)
en_1v8: C8.1 R5.2 U13.1(En)
en_2v5_aux: C19.1 R16.2 U12.1(En)
en_2v5_sfp: C5.1 R2.2 U20.1(En) ; port en_2v5_sfp
FB12: R7.2 R9.1 U14.7(Adj)
FB12_MGT: R10.2 R12.1 U21.7(Adj)
FB18: R4.2 R6.1 U13.7(Adj)
FB25_AUX: R15.2 R17.1 U12.7(Adj)
FB25_SFP: R1.2 R3.1 U20.7(Adj)

### Notes on the sheet
- +3.3V from Baseboard
- +1.8V from Baseboard
- (near U20) 5 Amp
- (near U14) 5 Amp
- 2.5V
- 1.192v
- Vref=0.500V
- 2.5V SFP
- 1.2V FPGA INT
- (near U12) 5 Amp
- (near U21) 5 Amp
- 2.5V AUX
- 1.2V MGT
- 5 Amp
- 1.801V
- 1.8V PROM
- Date:
- Rev:
- of
- Sheet
- (in symbol C0402C103K4RACTU) .
- (in symbol GRM21BR61E106KA73L) .
- (in symbol GRM188R6YA475KE15D) .
- (in symbol T491D227K016AT) +

### Library data of the parts
1V2_INT 1V2_MGT 1V8 2V5_AUX 2V5_SFP 3V3 VCORE = TPVIA: COMPSIDE: TOP; COMPGROUP: 0; mfgr: Layout; COMPROT: 0; Package: 90; mfgr_id: TPVIA; mfgr_foot: TPVIA
C1 C2 C9 C10 = GRM188R6YA475KE15D: as C301 on sheet FPGA_Power; Supplier 1: Digikey; Manufacturer Part Number: GRM188R6YA475KE15D; Category: Capacitors; Stock 1: 180441; Pricing 1: 1=0.32, 10=0.264, 50=0.1486, 100=0.132, 250=0.099, 500=0.0875, 1000=0.0776 (USD); Packaging: Tape & Reel (TR); Operating Temperature: -55°C ~ 85°C; Mounting Type: Surface Mount, MLCC; Size / Dimension: 0.063" L x 0.031" W (1.60mm x 0.80mm); ComponentLink1URL: https://datasheet.ciiva.com/46444/1769893-46444984.pdf; ComponentLink1Description: https://datasheet.ciiva.com/46444/1769893-46444984.pdf; Supplier 2: Digikey; Stock 2: 180441; Pricing 2: 1=0.32, 10=0.264, 50=0.1486, 100=0.132, 250=0.099, 500=0.0875, 1000=0.0776 (USD); Supplier Part Number 1: 490-7205-1-ND; Supplier Part Number 2: 490-7205-6-ND; Package / Case: 0603 (1608 Metric); Standard Package: 4,000; Family: Ceramic Capacitors; Series: GRM; Temperature Coefficient: X5R; Applications: General Purpose; Thickness (Max): 0.031" (0.80mm); ComponentLink2URL: https://datasheet.ciiva.com/46444/1769893-46444985.pdf; ComponentLink2Description: https://datasheet.ciiva.com/46444/1769893-46444985.pdf; ComponentLink3URL: https://datasheet.ciiva.com/14906/partnumbering-e-01-14906426.pdf; ComponentLink3Description: https://datasheet.ciiva.com/14906/partnumbering-e-01-14906426.pdf; ComponentLink4URL: https://datasheet.ciiva.com/14906/partnumbering-e-01-14906427.pdf; ComponentLink4Description: https://datasheet.ciiva.com/14906/partnumbering-e-01-14906427.pdf; ComponentLink5URL: https://datasheet.ciiva.com/14906/partnumbering-e-01-14906428.pdf; ComponentLink5Description: https://datasheet.ciiva.com/14906/partnumbering-e-01-14906428.pdf
C3 C4 C6 C7 C11 C12 C14 C15 C17 C18 = GRM21BR61E106KA73L: as C302 on sheet FPGA_Power; Supplier 1: Digi-Key; Manufacturer Part Number: GRM21BR61E106KA73L; RoHS: RoHS Compliant; Category: Capacitors; Stock 1: 607428; Pricing 1: 1=0.19, 10=0.13, 50=0.0748, 100=0.0618, 250=0.052, 500=0.04356, 1000=0.03575 (USD); Packaging: Cut Tape (CT); Part Status: Active; Temperature Coefficient: X5R; Operating Temperature: -55°C ~ 85°C; Features: -; Ratings: -; Applications: General Purpose; Mounting Type: Surface Mount, MLCC; Package / Case: 0805 (2012 Metric); Size / Dimension: 0.079" L x 0.049" W (2.00mm x 1.25mm); Height - Seated (Max): -; Thickness (Max): 0.053" (1.35mm); Lead Spacing: -; Lead Style: -; ComponentLink1URL: http://www.murata.com/~/media/webrenewal/support/library/catalog/products/capacitor/mlcc/c02e.pdf; ComponentLink1Description: http://www.murata.com/~/media/webrenewal/support/library/catalog/products/capacitor/mlcc/c02e.pdf; Supplier 2: Digi-Key; Supplier Part Number 1: 490-5523-1-ND; Supplier Part Number 2: 490-5523-6-ND
C5 C8 C13 C16 C19 = C0402C103K4RACTU: CAP CER 10nF 16V X7R 0402; Manufacturer: KEMET; Capacitance: 10000pF; Tolerance: ±10%; Supplier 1: Digi-Key; Manufacturer Part Number: C0402C103K4RACTU; RoHS: RoHS Compliant; Category: Capacitors; Stock 1: 605739; Pricing 1: 1=0.1, 10=0.02, 25=0.0144, 50=0.0108, 100=0.0088, 250=0.00732, 500=0.00626, 1000=0.00492, 5000=0.00412 (USD); Packaging: Cut Tape (CT); Part Status: Active; Temperature Coefficient: X7R; Operating Temperature: -55°C ~ 125°C; Features: -; Ratings: -; Applications: General Purpose; Failure Rate: -; Mounting Type: Surface Mount, MLCC; Package / Case: 0402 (1005 Metric); Size / Dimension: 0.039" L x 0.020" W (1.00mm x 0.50mm); Height - Seated (Max): -; Thickness (Max): 0.022" (0.55mm); Lead Spacing: -; Lead Style: -; ComponentLink1URL: http://www.kemet.com/docfinder?Partnumber=C0402C103K4RACTU; ComponentLink1Description: http://www.kemet.com/docfinder?Partnumber=C0402C103K4RACTU; Supplier 2: Digi-Key; Stock 2: 605739; Pricing 2: 1=0.1, 10=0.02, 25=0.0144, 50=0.0108, 100=0.0088, 250=0.00732, 500=0.00626, 1000=0.00492, 5000=0.00412 (USD); Supplier Part Number 1: 399-1038-1-ND; Supplier Part Number 2: 399-1038-6-ND
CT1-CT13 = T491D227K016AT: CAP TANT 220UF 16V 10% 2917; Manufacturer: KEMET; Manufacturer Size Code: D; Capacitance: 220µF; ESR (Equivalent Series Resistance): 500 mOhm; Lifetime @ Temp.: 2000 Hrs @ 85°C; Supplier 1: Digi-Key; Manufacturer Part Number: T491D227K016AT; RoHS: RoHS Compliant; Category: Capacitors; Stock 1: 48724; Pricing 1: 1=1.28, 10=1.009, 25=0.9248, 50=0.8744, 100=0.7568, 250=0.67268 (USD); Packaging: Cut Tape (CT); Part Status: Active; Tolerance: ±10%; Type: Molded; Operating Temperature: -55°C ~ 125°C; Mounting Type: Surface Mount; Package / Case: 2917 (7343 Metric); Size / Dimension: 0.287" L x 0.169" W (7.30mm x 4.30mm); Height - Seated (Max): 0.122" (3.10mm); Lead Spacing: -; Features: General Purpose; Failure Rate: -; ComponentLink1URL: http://www.kemet.com/Lists/ProductCatalog/Attachments/254/KEM_T2005_T491.pdf; ComponentLink1Description: http://www.kemet.com/Lists/ProductCatalog/Attachments/254/KEM_T2005_T491.pdf; Supplier 2: Digi-Key; Stock 2: 48724; Pricing 2: 1=1.28, 10=1.009, 25=0.9248, 50=0.8744, 100=0.7568, 250=0.67268 (USD); Supplier Part Number 1: 399-10429-1-ND; Supplier Part Number 2: 399-10429-6-ND
R1 R15 = ERA-2AEB122X: RES SMD 1.2K OHM 0.1% 1/16W 0402; Manufacturer: Panasonic Electronic Components; Power (Watts): 0.063W, 1/16W; Temperature Coefficient: ±25ppm/°C; Supplier 1: Digi-Key; Manufacturer Part Number: ERA-2AEB122X; RoHS: RoHS Compliant; Category: Resistors; Stock 1: 25790; Pricing 1: 1=0.45, 10=0.321, 100=0.1283, 1000=0.06322, 2500=0.05858, 5000=0.053 (USD); Packaging: Cut Tape (CT); Part Status: Active; Composition: Thin Film; Features: Automotive AEC-Q200; Operating Temperature: -55°C ~ 155°C; Package / Case: 0402 (1005 Metric); Size / Dimension: 0.039" L x 0.020" W (1.00mm x 0.50mm); Height - Seated (Max): 0.016" (0.40mm); Failure Rate: -; ComponentLink1URL: https://industrial.panasonic.com/cdbs/www-data/pdf/RDM0000/AOA0000C307.pdf; ComponentLink1Description: https://industrial.panasonic.com/cdbs/www-data/pdf/RDM0000/AOA0000C307.pdf; Supplier 2: Digi-Key; Stock 2: 25790; Pricing 2: 1=0.45, 10=0.321, 100=0.1283, 1000=0.06322, 2500=0.05858, 5000=0.053 (USD); Supplier Part Number 1: P1.2KDCCT-ND; Supplier Part Number 2: P1.2KDCDKR-ND; Supplier Device Package: 0402
R2 R5 R8 R11 R16 = CR0603-FX-4701ELF: as R81-R83 on sheet MGT; Tolerance: ±1%; Supplier 1: Digi-Key; Manufacturer Part Number: CR0603-FX-4701ELF; RoHS: RoHS Compliant; Category: Resistors; Stock 1: 43560; Pricing 1: 1=0.1, 10=0.021, 100=0.0086, 1000=0.00385, 2500=0.00334 (USD); Packaging: Cut Tape (CT); Part Status: Active; Resistance (Ohms): 4.7k; Composition: Thick Film; Features: Moisture Resistant; Operating Temperature: -55°C ~ 155°C; Package / Case: 0603 (1608 Metric); Size / Dimension: 0.063" L x 0.031" W (1.60mm x 0.80mm); Height - Seated (Max): 0.022" (0.55mm); Failure Rate: -; ComponentLink1URL: http://www.bourns.com/docs/Product-Datasheets/CHPREZTR.pdf; ComponentLink1Description: http://www.bourns.com/docs/Product-Datasheets/CHPREZTR.pdf; Supplier 2: Digi-Key; Stock 2: 43560; Pricing 2: 1=0.1, 10=0.021, 100=0.0086, 1000=0.00385, 2500=0.00334 (USD); Supplier Part Number 1: CR0603-FX-4701ELFCT-ND; Supplier Part Number 2: CR0603-FX-4701ELFDKR-ND
R3 R17 = ERA-2AEB301X: RES SMD 300 OHM 0.1% 1/16W 0402; Manufacturer: Panasonic Electronic Components; Power (Watts): 0.063W, 1/16W; Temperature Coefficient: ±25ppm/°C; Supplier 1: Digi-Key; Manufacturer Part Number: ERA-2AEB301X; RoHS: RoHS Compliant; Category: Resistors; Stock 1: 31760; Pricing 1: 1=0.45, 10=0.321, 100=0.1283, 1000=0.06322, 2500=0.05858, 5000=0.053 (USD); Packaging: Cut Tape (CT); Part Status: Active; Composition: Thin Film; Features: Automotive AEC-Q200; Operating Temperature: -55°C ~ 155°C; Package / Case: 0402 (1005 Metric); Supplier Device Package: 0402; Size / Dimension: 0.039" L x 0.020" W (1.00mm x 0.50mm); Height - Seated (Max): 0.016" (0.40mm); Failure Rate: -; ComponentLink1URL: https://industrial.panasonic.com/cdbs/www-data/pdf/RDM0000/AOA0000C307.pdf; ComponentLink1Description: https://industrial.panasonic.com/cdbs/www-data/pdf/RDM0000/AOA0000C307.pdf; Supplier 2: Digi-Key; Stock 2: 31760; Pricing 2: 1=0.45, 10=0.321, 100=0.1283, 1000=0.06322, 2500=0.05858, 5000=0.053 (USD); Supplier Part Number 1: P300DCCT-ND; Supplier Part Number 2: P300DCDKR-ND
R4 = ERA-2AEB512X: RES SMD 5.1K OHM 0.1% 1/16W 0402; Manufacturer: Panasonic Electronic Components; Power (Watts): 0.063W, 1/16W; Temperature Coefficient: ±25ppm/°C; Supplier 1: Digi-Key; Manufacturer Part Number: ERA-2AEB512X; RoHS: RoHS Compliant; Category: Resistors; Stock 1: 26098; Pricing 1: 1=0.61, 50=0.238, 100=0.1913, 250=0.14876, 500=0.1122, 1000=0.0867, 5000=0.0646 (USD); Packaging: Cut Tape (CT); Part Status: Active; Resistance (Ohms): 5.1k; Composition: Thin Film; Features: Automotive AEC-Q200; Operating Temperature: -55°C ~ 155°C; Package / Case: 0402 (1005 Metric); Size / Dimension: 0.039" L x 0.020" W (1.00mm x 0.50mm); Height - Seated (Max): 0.016" (0.40mm); Failure Rate: -; ComponentLink1URL: https://industrial.panasonic.com/cdbs/www-data/pdf/RDA0000/AOA0000C237.pdf; ComponentLink1Description: https://industrial.panasonic.com/cdbs/www-data/pdf/RDA0000/AOA0000C237.pdf; Supplier 2: Digi-Key; Stock 2: 26098; Pricing 2: 1=0.61, 50=0.238, 100=0.1913, 250=0.14876, 500=0.1122, 1000=0.0867, 5000=0.0646 (USD); Supplier Part Number 1: P5.1KDCCT-ND; Supplier Part Number 2: P5.1KDCDKR-ND; Number of Terminations: 2
R6 = ERA-2AEB1961X: RES SMD 1.96K OHM 0.1% 1/16W 0402; Manufacturer: Panasonic Electronic Components; Power (Watts): 0.063W, 1/16W; Temperature Coefficient: ±25ppm/°C; Supplier 1: Digi-Key; Manufacturer Part Number: ERA-2AEB1961X; RoHS: RoHS Compliant; Category: Resistors; Stock 1: 36796; Pricing 1: 1=0.45, 10=0.321, 100=0.1283, 1000=0.06322, 2500=0.05858, 5000=0.053 (USD); Packaging: Cut Tape (CT); Part Status: Active; Composition: Thin Film; Features: Automotive AEC-Q200; Operating Temperature: -55°C ~ 155°C; Package / Case: 0402 (1005 Metric); Size / Dimension: 0.039" L x 0.020" W (1.00mm x 0.50mm); Height - Seated (Max): 0.016" (0.40mm); Failure Rate: -; ComponentLink1URL: https://industrial.panasonic.com/cdbs/www-data/pdf/RDM0000/AOA0000C307.pdf; ComponentLink1Description: https://industrial.panasonic.com/cdbs/www-data/pdf/RDM0000/AOA0000C307.pdf; Supplier 2: Digi-Key; Stock 2: 36796; Pricing 2: 1=0.45, 10=0.321, 100=0.1283, 1000=0.06322, 2500=0.05858, 5000=0.053 (USD); Supplier Part Number 1: P1.96KDCCT-ND; Supplier Part Number 2: P1.96KDCDKR-ND; Supplier Device Package: 0402
R7 R10 = ERA-2AEB182X: RES SMD 1.8k OHM 0.1% 1/16W 0402; Manufacturer: Panasonic Electronic Components; Power (Watts): 0.063W, 1/16W; Temperature Coefficient: ±25ppm/°C; Supplier 1: Digi-Key; Manufacturer Part Number: ERA-2AEB182X; RoHS: RoHS Compliant; Category: Resistors; Packaging: Cut Tape (CT); Part Status: Active; Composition: Thin Film; Features: Automotive AEC-Q200; Operating Temperature: -55°C ~ 155°C; Package / Case: 0402 (1005 Metric); Size / Dimension: 0.039" L x 0.020" W (1.00mm x 0.50mm); Height - Seated (Max): 0.016" (0.40mm); Failure Rate: -; Supplier 2: Digi-Key; Supplier Part Number 1: P1.8KDCCT-ND; Supplier Part Number 2: P1.8KDCDKR-ND
  R7: Stock 1: 43633; Pricing 1: 1=0.45, 10=0.321, 100=0.1283, 1000=0.06322, 2500=0.05858, 5000=0.053 (USD); ComponentLink1URL: https://industrial.panasonic.com/cdbs/www-data/pdf/RDM0000/AOA0000C307.pdf; ComponentLink1Description: https://industrial.panasonic.com/cdbs/www-data/pdf/RDM0000/AOA0000C307.pdf; Stock 2: 43633; Pricing 2: 1=0.45, 10=0.321, 100=0.1283, 1000=0.06322, 2500=0.05858, 5000=0.053 (USD); Supplier Device Package: 0402
  R10: Stock 1: 39375; Pricing 1: 1=0.6, 50=0.2484, 100=0.2052, 250=0.162, 500=0.13824, 1000=0.10368, 5000=0.07776 (USD); Resistance (Ohms): 1.8k; ComponentLink1URL: https://industrial.panasonic.com/cdbs/www-data/pdf/RDA0000/AOA0000C237.pdf; ComponentLink1Description: https://industrial.panasonic.com/cdbs/www-data/pdf/RDA0000/AOA0000C237.pdf; Stock 2: 39375; Pricing 2: 1=0.6, 50=0.2484, 100=0.2052, 250=0.162, 500=0.13824, 1000=0.10368, 5000=0.07776 (USD); Number of Terminations: 2
R9 R12 = ERA-2AEB132X: RES SMD 1.3k OHM 0.1% 1/16W 0402; Manufacturer: Panasonic Electronic Components; Power (Watts): 0.063W, 1/16W; Temperature Coefficient: ±25ppm/°C; Supplier 1: Digi-Key; Manufacturer Part Number: ERA-2AEB132X; RoHS: RoHS Compliant; Category: Resistors; Stock 1: 249; Pricing 1: 1=0.45, 10=0.321, 100=0.1283, 1000=0.06322, 2500=0.05858, 5000=0.053 (USD); Packaging: Cut Tape (CT); Part Status: Active; Composition: Thin Film; Features: Automotive AEC-Q200; Operating Temperature: -55°C ~ 155°C; Package / Case: 0402 (1005 Metric); Size / Dimension: 0.039" L x 0.020" W (1.00mm x 0.50mm); Height - Seated (Max): 0.016" (0.40mm); Failure Rate: -; ComponentLink1URL: https://industrial.panasonic.com/cdbs/www-data/pdf/RDM0000/AOA0000C307.pdf; ComponentLink1Description: https://industrial.panasonic.com/cdbs/www-data/pdf/RDM0000/AOA0000C307.pdf; Supplier 2: Digi-Key; Stock 2: 249; Pricing 2: 1=0.45, 10=0.321, 100=0.1283, 1000=0.06322, 2500=0.05858, 5000=0.053 (USD); Supplier Part Number 1: P1.3KDCCT-ND; Supplier Part Number 2: P1.3KDCDKR-ND
U12-U14 U20 U21 = MIC69502WR: IC REG LDO ADJ 5A SPAK-7; Manufacturer: Microchip Technology; Control Features: Enable; Output Configuration: Positive; Output Type: Adjustable; Protection Features: Over Current, Over Temperature; Voltage - Input (Max): 5.5V; Voltage - Output (Min/Fixed): 0.5V; Voltage Dropout (Max): 0.5V @ 5A; Category: Integrated Circuits (ICs); ComponentLink1Description: http://www.microchip.com/mymicrochip/filehandler.aspx?ddocname=en580586; ComponentLink1URL: http://www.microchip.com/mymicrochip/filehandler.aspx?ddocname=en580586; Current - Output: 5A; Manufacturer Part Number: MIC69502WR; Mounting Type: Surface Mount; Operating Temperature: -40°C ~ 125°C; Package / Case: SPak-7 (7 leads + Tab); Packaging: Tube; Part Status: Active; Pricing 1: 1=2.98, 25=2.4884, 100=2.2575 (USD); PSRR: -; RoHS: RoHS Compliant; Stock 1: 2547; Supplier 1: Digi-Key; Supplier Device Package: S-PAK-7; Supplier Part Number 1: 576-1613-ND; Voltage - Output (Max): 5.5V